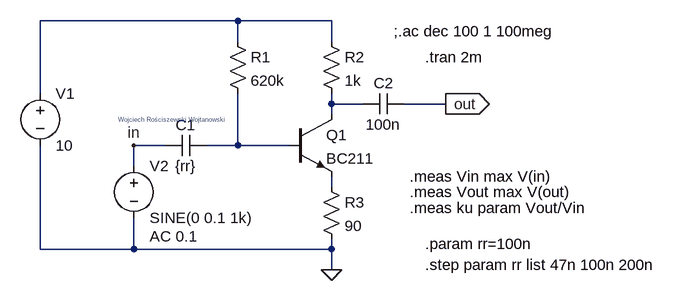
[diagram p0: schematic transistor amplifier circuit 1.asc]
transistor amplifier circuit 1.asc, the LTspice schematic file:
Version 4
SHEET 1 1000 680
WIRE 320 -16 16 -16
WIRE 464 -16 320 -16
WIRE 320 16 320 -16
WIRE 464 16 464 -16
WIRE 16 96 16 -16
WIRE 464 112 464 96
WIRE 512 112 464 112
WIRE 640 112 576 112
WIRE 464 128 464 112
WIRE 208 176 160 176
WIRE 320 176 320 96
WIRE 320 176 272 176
WIRE 400 176 320 176
WIRE 160 208 160 176
WIRE 464 240 464 224
WIRE 16 336 16 176
WIRE 160 336 160 288
WIRE 160 336 16 336
WIRE 464 336 464 320
WIRE 464 336 160 336
WIRE 464 368 464 336
FLAG 464 368 0
FLAG 640 112 out
IOPIN 640 112 Out
FLAG 160 176 in
SYMBOL voltage 16 80 R0
WINDOW 123 0 0 Left 0
WINDOW 39 0 0 Left 0
SYMATTR InstName V1
SYMATTR Value 10
SYMBOL voltage 160 192 R0
WINDOW 123 24 124 Left 2
WINDOW 39 0 0 Left 0
SYMATTR Value2 AC 0.1
SYMATTR InstName V2
SYMATTR Value SINE(0 0.1 1k)
SYMBOL cap 272 160 R90
WINDOW 0 0 32 VBottom 2
WINDOW 3 32 32 VTop 2
SYMATTR InstName C1
SYMATTR Value {rr}
SYMBOL res 304 0 R0
SYMATTR InstName R1
SYMATTR Value 620k
SYMBOL res 448 0 R0
SYMATTR InstName R2
SYMATTR Value 1k
SYMBOL res 448 224 R0
SYMATTR InstName R3
SYMATTR Value 90
SYMBOL cap 576 96 R90
WINDOW 0 0 32 VBottom 2
WINDOW 3 32 32 VTop 2
SYMATTR InstName C2
SYMATTR Value 100n
SYMBOL npn 400 128 R0
SYMATTR InstName Q1
SYMATTR Value BC211
TEXT 136 136 Left 0 ;Wojciech Rościszewski Wojtanowski
TEXT 608 40 Left 2 !.tran 2m
TEXT 560 0 Left 2 !;.ac dec 100 1 100meg
TEXT 584 224 Left 2 !.meas Vin max V(in)
TEXT 584 248 Left 2 !.meas Vout max V(out)
TEXT 584 272 Left 2 !.meas ku param Vout/Vin
TEXT 608 328 Left 2 !.param rr=100n
TEXT 608 360 Left 2 !.step param rr list 47n 100n 200n

The netlist it stands for:
* transistor amplifier circuit 1.asc
V1 N001 0 10
V2 in 0 SINE(0 0.1 1k) AC 0.1
C1 N003 in {rr}
R1 N001 N003 620k
R2 N001 N002 1k
R3 N004 0 90
C2 out N002 100n
Q1 N002 N003 N004 0 BC211
.model NPN NPN
.model PNP PNP
.lib standard.bjt
* Wojciech Rościszewski Wojtanowski
.tran 2m
;.ac dec 100 1 100meg
.meas Vin max V(in)
.meas Vout max V(out)
.meas ku param Vout/Vin
.param rr=100n
.step param rr list 47n 100n 200n
.backanno
.end